# EAGLE schematic Schmitz VCO (EAGLE 7.4.0)
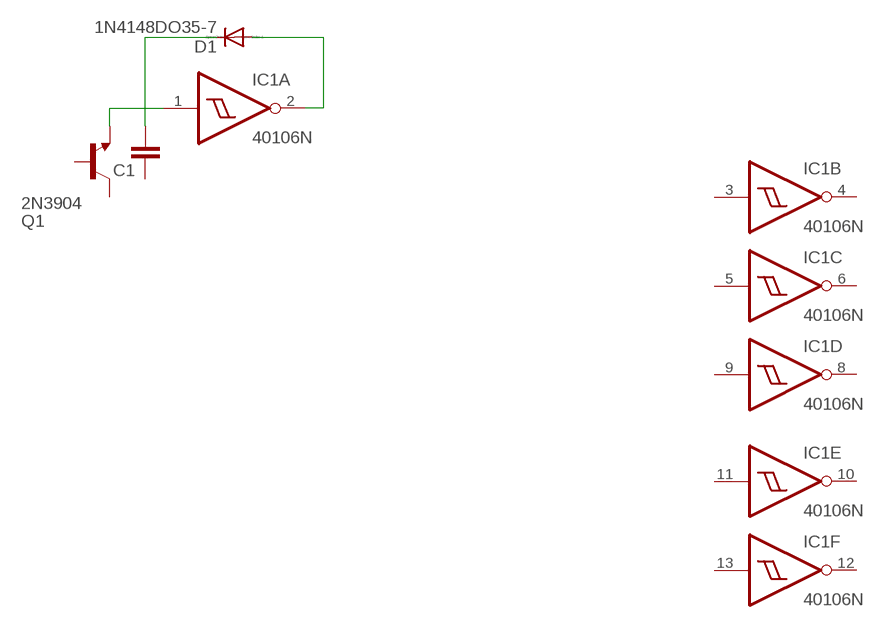
[diagram p0: schematic, sheet 1]

## Parts
C1  C-EU075-032X103  [C075-032X103]
D1  1N4148DO35-7  [DO35-7]
IC1  40106N  [DIL14]
Q1  2N3904  [TO92]

## Nets
N$1: C1.2 D1.C IC1.1(A:I) Q1.3(E)
N$2: D1.A IC1.2(A:O)
Unconnected: C1.1 IC1.3(B:I) IC1.4(B:O) IC1.5(C:I) IC1.6(C:O) IC1.8(D:O) IC1.9(D:I) IC1.10(E:O) IC1.11(E:I) IC1.12(F:O) IC1.13(F:I) Q1.1(C) Q1.2(B)

## Power pins joined to a net without a drawn wire
VDD: IC1.14(P:VDD)
VSS: IC1.7(P:VSS)

## Library data of the parts
C1 = rcl:C-EU: CAPACITOR, European symbol
D1 = diode:1N4148: DIODE high speed (Philips)
IC1 = 40xx:40106: Hex SCHMITT TRIGGER
Q1 = transistor-npn:2N3904: NPN Transistor